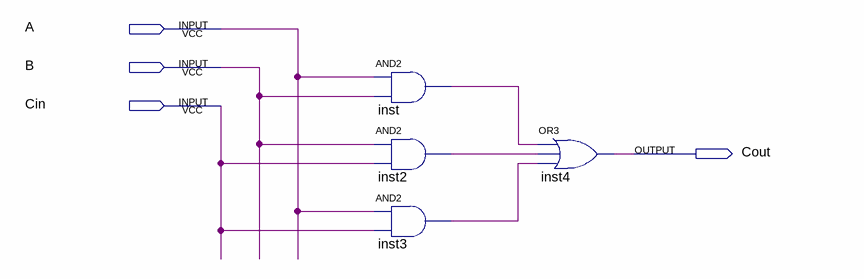
[diagram p0: schematic sheet]
// Quartus schematic Carry(Cout).bdf as structural Verilog: 4 symbols, 4 pins
module \Carry(Cout)  (
  input  A,
  input  B,
  input  Cin,
  output Cout
);

  wire inst2_out, inst3_out, inst_out;

  and inst (inst_out, A, B);
  and inst2 (inst2_out, B, Cin);
  and inst3 (inst3_out, A, Cin);
  or inst4 (Cout, inst_out, inst2_out, inst3_out);
endmodule
